# EAGLE design Signal Gen (EAGLE 7.4.0)
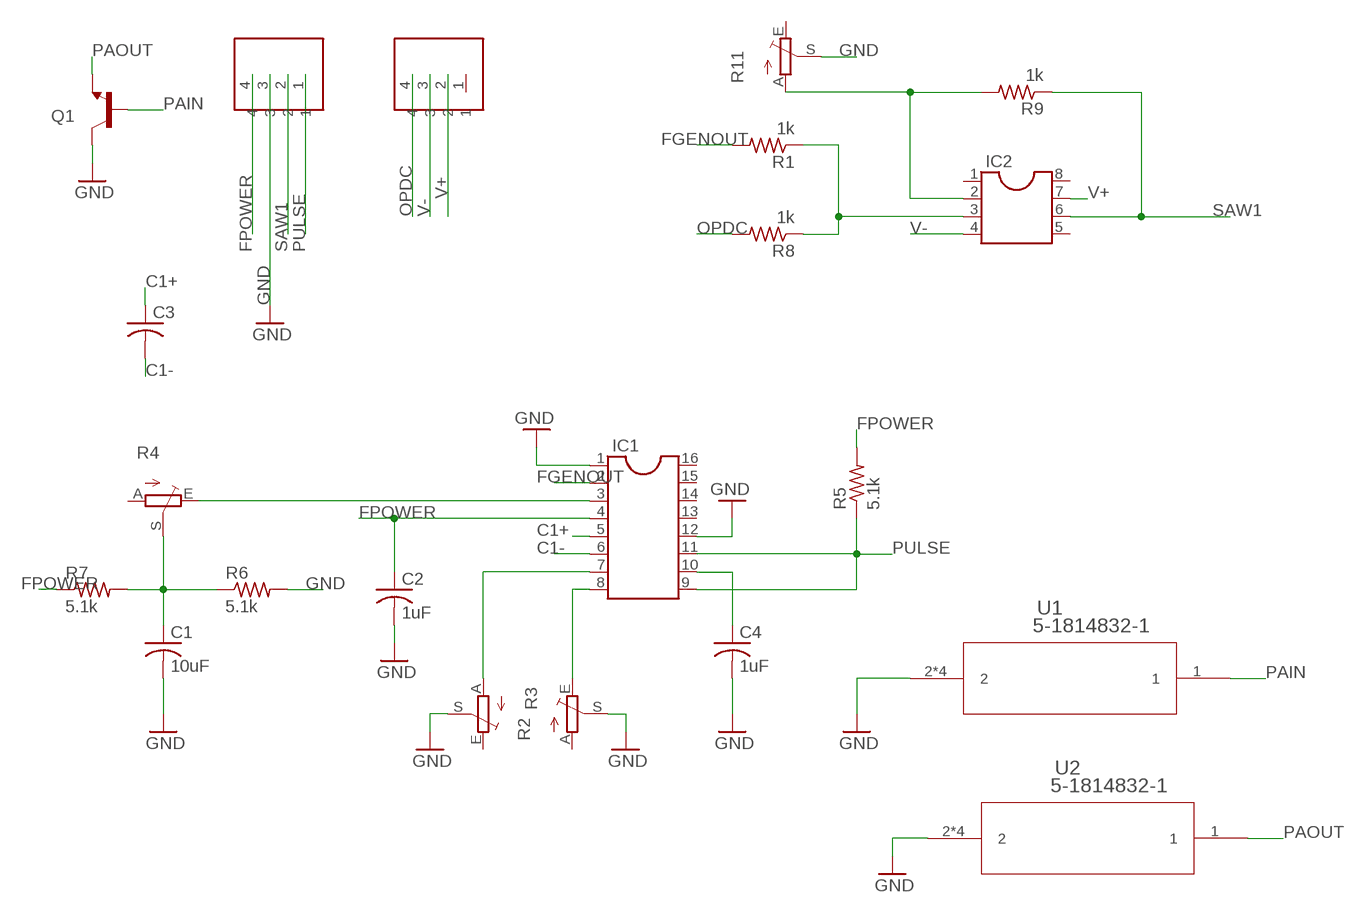
[diagram p0: schematic, sheet 1]

## Parts
C1  10uF  C-US025-025X050  [C025-025X050]
C2  1uF  C-US025-025X050  [C025-025X050]
C3  C-US025-025X050  [C025-025X050]
C4  1uF  C-US025-025X050  [C025-025X050]
IC1  DIL16S  [SOCKET-16]
IC2  DIL8S  [SOCKET-08]
Q1  TRANSISTOR_NPNSOT89  [SOT89]
R1  1k  R-US_0204/7  [0204/7]
R2  TRIM_EU-B25U  [B25U]
R3  TRIM_EU-B25U  [B25U]
R4  TRIM_EU-B64W  [B64W]
R5  5.1k  R-US_0204/7  [0204/7]
R6  5.1k  R-US_0204/7  [0204/7]
R7  5.1k  R-US_0204/7  [0204/7]
R8  1k  R-US_0204/7  [0204/7]
R9  1k  R-US_0204/7  [0204/7]
R11  TRIM_EU-RJ9W  [RJ9W]
U1  5-1814832-1  [5-1814832-1]
U2  5-1814832-1  [5-1814832-1]
U$1  ED2582-ND  [ED2582-ND]
U$2  ED2582-ND  [ED2582-ND]

## Nets
C1+: C3.1 IC1.5
C1-: C3.2 IC1.6
FGENOUT: IC1.2 R1.2
FPOWER: C2.1 IC1.4 R5.2 R7.1 U$1.4
GND: C1.2 C2.2 C4.2 IC1.1 IC1.12 Q1.2(C) R2.S R3.S R6.2 R11.S U1.2 U1.3 U1.4 U1.5 U2.2 U2.3 U2.4 U2.5 U$1.3
N$1: IC1.3 R4.E
N$2: C1.1 R4.S R6.1 R7.2
N$3: IC1.7 R3.A
N$4: IC1.8 R2.E
N$6: C4.1 IC1.10
N$22: IC2.3 R1.1 R8.1
N$23: IC2.2 R9.2 R11.A
OPDC: R8.2 U$2.4
PAIN: Q1.1(B) U1.1
PAOUT: Q1.3(E) U2.1
PULSE: IC1.9 IC1.11 R5.1 U$1.1
SAW1: IC2.6 R9.1 U$1.2
V+: IC2.7 U$2.2
V-: IC2.4 U$2.3
Unconnected: IC1.13 IC1.14 IC1.15 IC1.16 IC2.1 IC2.5 IC2.8 R2.A R3.E R4.A R11.E U$2.1

## Library data of the parts
C1-C4 = rcl:C-US: CAPACITOR, American symbol
IC1 = ic-package:DIL16: Dual In Line / Socket
IC2 = ic-package:DIL8: Dual In Line / Socket
Q1 = SparkFun-DiscreteSemi:TRANSISTOR_NPN: Generic NPN BJT MMBT2222A - TRANS-08049 (SOT-23, 1A 40V) MPSA42 - TRANS-09116 (SOT-23, 500mA 300V) MMBT5088LT1G - TRANS-11160 (SOT-23, 50 mA 30V) BC547 - COM-08928 <http://www.sparkfun.com/products/8928> (TO-92 45V 100mA) (1.Collector 2.Base 3.Emitter) 2N3904 - COM-00521 <http://www.sparkfun.com/products/521> (TO-92 40V 200mA) (1.Emitter 2.Base 3.Collector) P2N2222A - COM-12852 <http://www.sparkfun.com/products/12852> (TO-92 40V 600mA) (1.Collector 2.Base 3.Emitter)
R1 R5-R9 = resistor:R-US_: RESISTOR, American symbol
R2-R4 R11 = pot:TRIM_EU-: POTENTIOMETER
U1 U2 = SMAConnector:5-1814832-1; COPYRIGHT: Copyright (C) 2015 Accelerated Designs. All rights reserved; MANUFACTURER_PART_NUMBER: 5-1814832-1; VENDOR: Tyco Electronics
U$1 U$2 = untitled (1):ED2582-ND

## Net classes
0 default: width 0.305 mm, drill 0.508 mm, clearance 0.254 mm

## Board
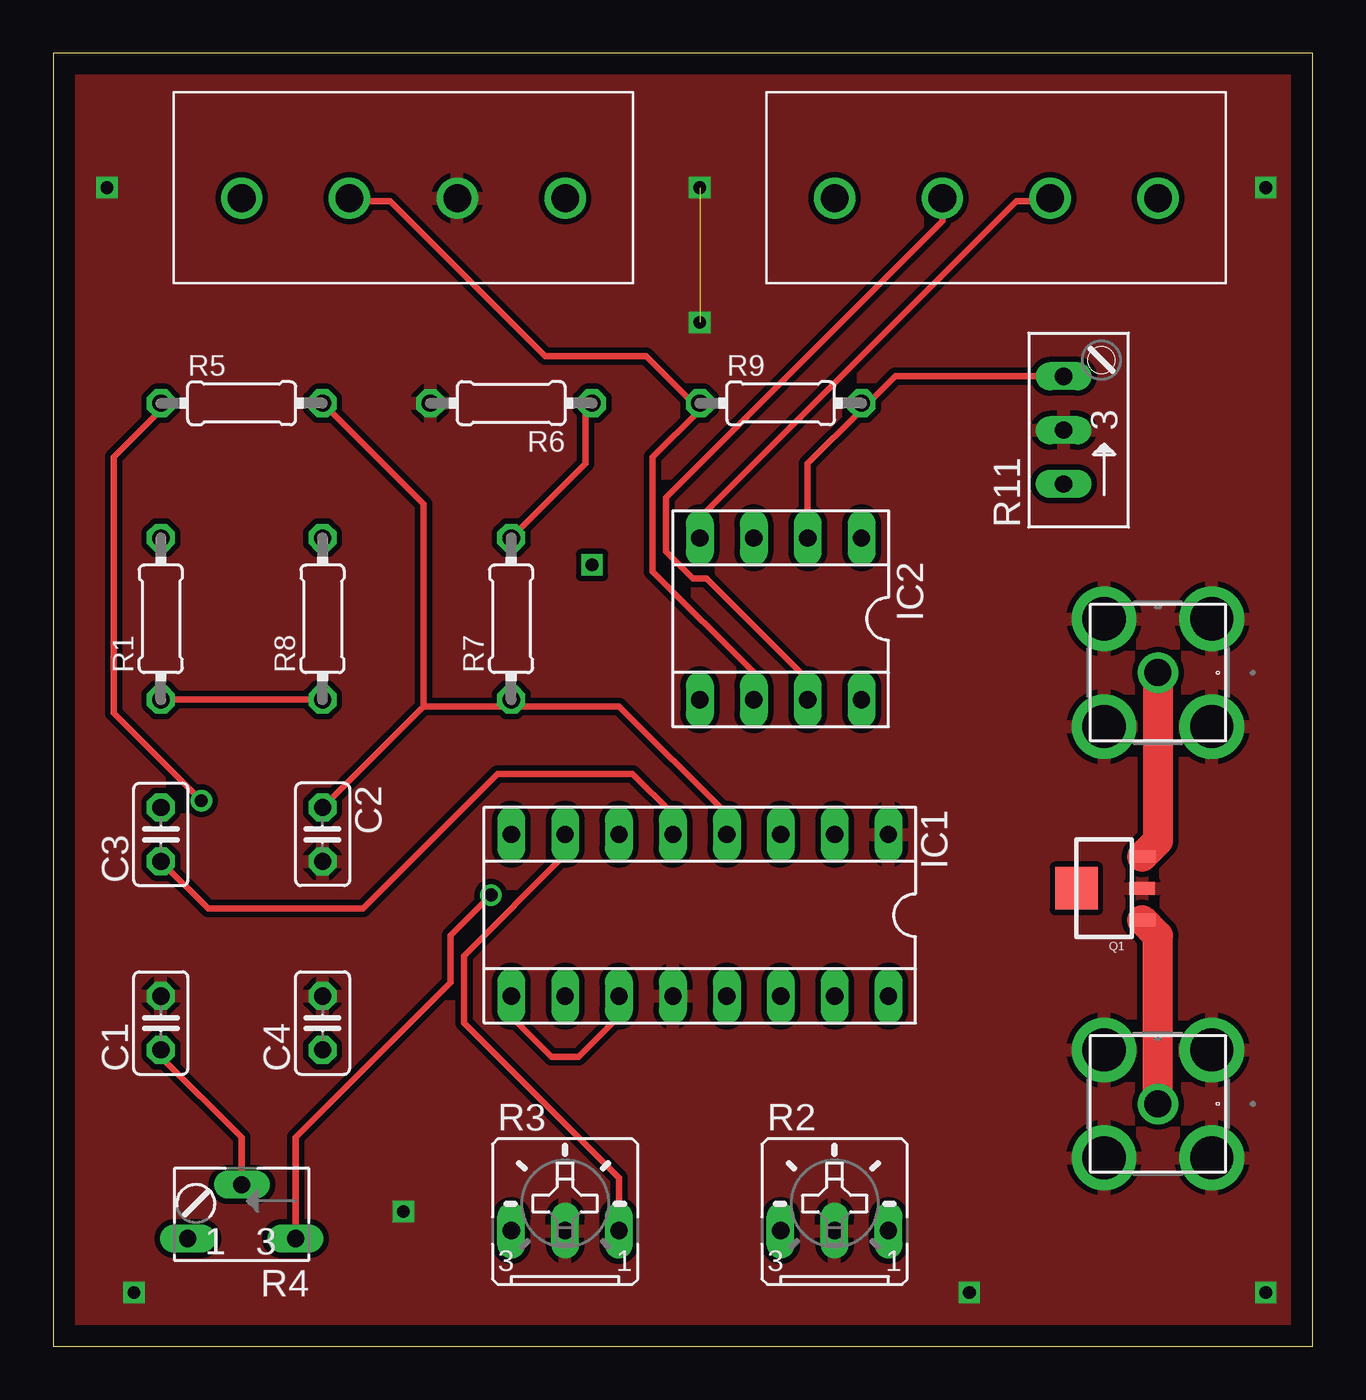
[diagram p1: board, top side]
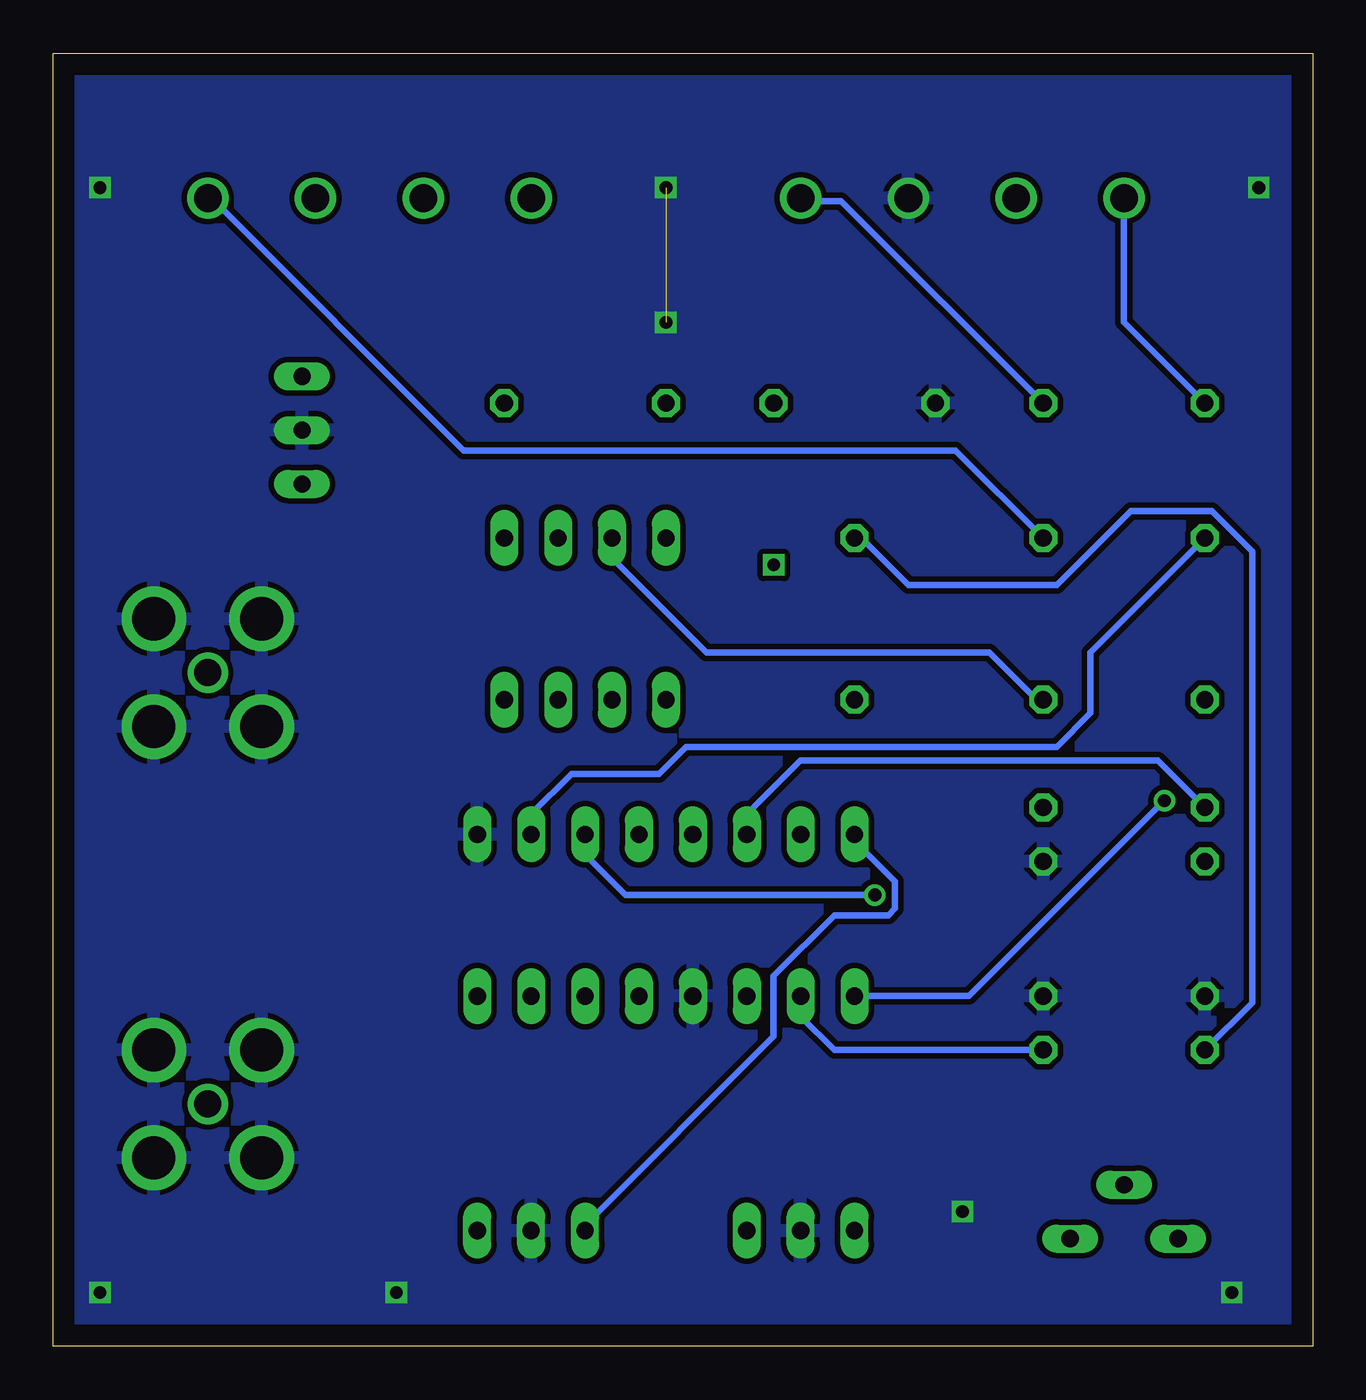
[diagram p2: board, bottom side, seen from below]

Size 59.36 x 60.95 mm. Coordinates in mm from the lower left corner, seen from the top.
Outline: 0,0 59.36,0 59.36,60.95 0,60.95 0,0
Copper layers (1*16): Top 0.035mm / dielectric 1.5mm / Bottom 0.035mm
Design rules "default": minimum track width 10mil, minimum drill 24mil, track to track 8mil, track to pad 8mil, pad to pad 8mil, via to via 8mil, smd to smd 8mil, copper to edge 40mil, drill to drill 8mil, minimum pad ring 10mil, minimum via ring 8mil, stop-mask expansion 4mil, vias tented up to drill 0mil, thermal gap 10mil

### Footprints (pad centres in the part's own frame; a part is rotated, then mirrored left to right if it is on the bottom)
C025-025X050 = drill 0.813 octagon: 1 -1.27,0; 2 1.27,0
SOCKET-16 = drill 0.813 long: 1 -8.89,-3.81; 2 -6.35,-3.81; 3 -3.81,-3.81; 4 -1.27,-3.81; 5 1.27,-3.81; 6 3.81,-3.81; 7 6.35,-3.81; 8 8.89,-3.81; 9 8.89,3.81; 10 6.35,3.81; 11 3.81,3.81; 12 1.27,3.81; 13 -1.27,3.81; 14 -3.81,3.81; 15 -6.35,3.81; 16 -8.89,3.81
SOCKET-08 = drill 0.813 long: 1 -3.81,-3.81; 2 -1.27,-3.81; 3 1.27,-3.81; 4 3.81,-3.81; 5 3.81,3.81; 6 1.27,3.81; 7 -1.27,3.81; 8 -3.81,3.81
SOT89 = smd 0.58 x 1.2: 1 -1.5,-1.8; 2 0,-1.8; 3 1.5,-1.8 | smd 2 x 2: 4 0,1.3
0204/7 = drill 0.813 octagon: 1 -3.81,0; 2 3.81,0
B25U = drill 0.813 long: A 2.54,-0.889; E -2.54,-0.889; S 0,-0.889
B64W = drill 0.813 long: A 2.54,0; E -2.54,0; S 0,-2.54
RJ9W = drill 0.813 long: A 2.54,0.635; E -2.54,0.635; S 0,0.635
5-1814832-1 = drill 1.27 pad 1.778: 1 0,0 | drill 2.032 pad 2.54: 2 -2.54,2.54; 3 -2.54,-2.54; 4 2.54,-2.54; 5 2.54,2.54
ED2582-ND = drill 1.3: 1 -7.62,-0.5; 2 -2.54,-0.5; 3 2.54,-0.5; 4 7.62,-0.5

### Placement (x,y rotation side)
C1  5.08,15.24 90 top
C2  12.7,24.13 270 top
C3  5.08,24.13 90 top
C4  12.7,15.24 90 top
IC1  30.48,20.32 180 top
IC2  34.29,34.29 180 top
Q1  49.53,21.59 90 top
R1  5.08,34.29 90 top
R2  36.83,6.35 0 top
R3  24.13,6.35 0 top
R4  8.89,5.08 180 top
R5  8.89,44.45 0 top
R6  21.59,44.45 180 top
R7  21.59,34.29 90 top
R8  12.7,34.29 90 top
R9  34.29,44.45 0 top
R11  48.26,43.18 90 top
U1  52.07,11.43 0 top
U2  52.07,31.75 0 top
U$1  16.51,54.61 0 top
U$2  44.45,54.61 0 top

### Tracks (layer width: path | path; a pad name or v marks a point on that pad's centre or on a via)
C1+
  Top 0.305: C3.1 7.3,20.64 14.61,20.64 20.95,26.99 27.3,26.99 29.21,25.08 IC1.5
C1-
  Bottom 0.305: C3.2 7.3,27.62 24.13,27.62 26.67,25.08 IC1.6
FGENOUT
  Bottom 0.305: R1.2 10.48,32.7 10.48,29.84 12.06,28.26 29.53,28.26 30.8,26.99 34.92,26.99 36.83,25.08 IC1.2
FPOWER
  Top 0.305: 17.46,30.16 C2.1 | 21.27,30.16 17.46,30.16 | IC1.4 31.75,25.08 26.67,30.16 21.27,30.16 | 21.27,30.16 R7.1 | R5.2 17.46,39.69 17.46,30.16
  Bottom 0.305: R5.2 22.23,53.98 24.13,53.98 U$1.4
GND  (via drill 0.6)  (1 unrouted)
  other vias: 2.54,54.61 30.48,54.61 57.15,54.61 57.15,2.54 43.18,2.54 3.81,2.54 16.51,6.35 30.48,48.26
  pour Bottom: -3.81,63.5 -3.81,-2.54 62.23,-2.54 60.96,63.5
  pour Top: -2.54,64.77 -2.54,-2.54 62.23,-2.54 60.96,64.77
N$1  (via drill 0.61)
  Top 0.305: R4.E 11.43,9.84 18.73,17.14 18.73,19.37 v20.64,21.27
  Bottom 0.305: v20.64,21.27 32.38,21.27 34.29,23.18 IC1.3
N$2
  Top 0.305: R4.S 8.89,9.84 5.08,13.65 C1.1 | R7.2 25.08,41.59 25.08,44.13 R6.1
  Bottom 0.305: C1.1 2.86,16.19 2.86,37.47 4.76,39.37 8.57,39.37 12.06,35.88 19.05,35.88 21.27,38.1 R7.2
N$3
  Top 0.305: R3.A 26.67,7.94 19.37,15.24 19.37,18.41 24.13,23.18 IC1.7
N$4
  Bottom 0.305: IC1.8 21.59,23.81 19.68,21.91 19.68,20.64 20,20.32 22.54,20.32 25.4,17.46 25.4,14.61 34.29,5.71 R2.E
N$6
  Bottom 0.305: C4.1 22.54,13.97 24.13,15.56 IC1.10
N$13  (via drill 0.6)
  other vias: 25.4,36.83
N$22
  Top 0.305: R8.1 R1.1
  Bottom 0.305: IC2.3 33.02,37.15 28.57,32.7 15.24,32.7 13.02,30.48 R8.1
N$23
  Top 0.305: IC2.2 35.56,41.59 38.1,44.13 | R11.A 39.69,45.72 38.1,44.13 | 38.1,44.13 R9.2
OPDC
  Bottom 0.305: R8.2 16.83,42.23 40.01,42.23 52.07,54.29 U$2.4
PAIN
  Top 1.422: U1.1 52.07,19.35 Q1.1
PAOUT
  Top 1.422: U2.1 52.07,23.83 Q1.3
PULSE  (via drill 0.61)
  Top 0.305: IC1.9 21.59,15.56 23.5,13.65 24.77,13.65 26.67,15.56 IC1.11 | v6.99,25.72 2.86,29.84 2.86,41.91 5.08,44.13 R5.1
  Bottom 0.305: R5.1 8.89,48.26 U$1.1 | IC1.9 16.19,16.51 v6.99,25.72
SAW1
  Top 0.305: IC2.6 33.02,31.75 28.26,36.51 28.26,41.91 30.48,44.13 | 30.48,44.13 27.94,46.67 23.18,46.67 15.88,53.98 13.97,53.98 U$1.2 | 30.48,44.13 R9.1
V+
  Top 0.305: IC2.7 35.56,31.43 30.8,36.2 30.16,36.2 28.89,37.47 28.89,40.01 41.91,53.02 U$2.2
V-
  Top 0.305: IC2.4 30.48,39.05 45.4,53.98 46.99,53.98 U$2.3